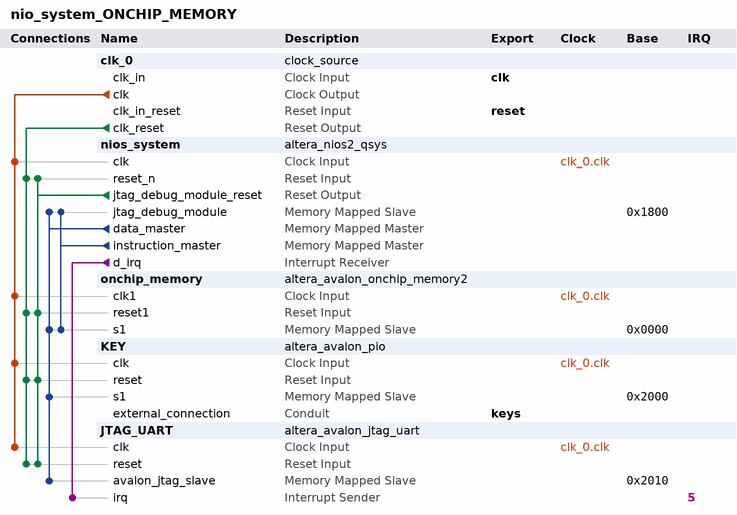
[diagram p0: system contents]
# Platform Designer (Qsys) system nio_system_ONCHIP_MEMORY, Cyclone II EP2C35F672C6
# Parameters at their usual value, and those the tool derives, are not listed.
package require -exact qsys 12.0
create_system nio_system_ONCHIP_MEMORY
set_project_property DEVICE_FAMILY {Cyclone II}
set_project_property DEVICE EP2C35F672C6

add_instance clk_0 clock_source 12.0
set_instance_parameter_value clk_0 clockFrequency 50000000

add_instance nios_system altera_nios2_qsys 12.0
set_instance_parameter_value nios_system resetSlave onchip_memory.s1
set_instance_parameter_value nios_system exceptionSlave onchip_memory.s1
set_instance_parameter_value nios_system breakSlave nios_system.jtag_debug_module
set_instance_parameter_value nios_system impl Small
set_instance_parameter_value nios_system icache_size 4096

add_instance onchip_memory altera_avalon_onchip_memory2 12.0
set_instance_parameter_value onchip_memory dataWidth 32
set_instance_parameter_value onchip_memory dualPort false
set_instance_parameter_value onchip_memory initMemContent true
set_instance_parameter_value onchip_memory initializationFileName onchip_memory
set_instance_parameter_value onchip_memory memorySize 4096

add_instance KEY altera_avalon_pio 12.0
set_instance_parameter_value KEY direction Input
set_instance_parameter_value KEY width 4

add_instance JTAG_UART altera_avalon_jtag_uart 12.0
set_instance_parameter_value JTAG_UART simInteractiveOptions INTERACTIVE_ASCII_OUTPUT

# connections
add_connection clk_0.clk JTAG_UART.clk clock
add_connection clk_0.clk KEY.clk clock
add_connection clk_0.clk nios_system.clk clock
add_connection clk_0.clk onchip_memory.clk1 clock
add_connection clk_0.clk_reset JTAG_UART.reset reset
add_connection clk_0.clk_reset KEY.reset reset
add_connection clk_0.clk_reset nios_system.reset_n reset
add_connection clk_0.clk_reset onchip_memory.reset1 reset
add_connection nios_system.jtag_debug_module_reset JTAG_UART.reset reset
add_connection nios_system.jtag_debug_module_reset KEY.reset reset
add_connection nios_system.jtag_debug_module_reset nios_system.reset_n reset
add_connection nios_system.jtag_debug_module_reset onchip_memory.reset1 reset
add_connection nios_system.data_master JTAG_UART.avalon_jtag_slave avalon
set_connection_parameter_value nios_system.data_master/JTAG_UART.avalon_jtag_slave baseAddress 0x2010
add_connection nios_system.data_master KEY.s1 avalon
set_connection_parameter_value nios_system.data_master/KEY.s1 baseAddress 0x2000
add_connection nios_system.data_master nios_system.jtag_debug_module avalon
set_connection_parameter_value nios_system.data_master/nios_system.jtag_debug_module baseAddress 0x1800
add_connection nios_system.data_master onchip_memory.s1 avalon
set_connection_parameter_value nios_system.data_master/onchip_memory.s1 baseAddress 0x0000
add_connection nios_system.instruction_master nios_system.jtag_debug_module avalon
set_connection_parameter_value nios_system.instruction_master/nios_system.jtag_debug_module baseAddress 0x1800
add_connection nios_system.instruction_master onchip_memory.s1 avalon
set_connection_parameter_value nios_system.instruction_master/onchip_memory.s1 baseAddress 0x0000
add_connection nios_system.d_irq JTAG_UART.irq interrupt
set_connection_parameter_value nios_system.d_irq/JTAG_UART.irq irqNumber 5

# exported interfaces
add_interface clk clock sink
set_interface_property clk EXPORT_OF clk_0.clk_in
add_interface reset reset sink
set_interface_property reset EXPORT_OF clk_0.clk_in_reset
add_interface keys conduit end
set_interface_property keys EXPORT_OF KEY.external_connection

save_system nio_system_ONCHIP_MEMORY.qsys
